# EAGLE design pandora_A_v1 (EAGLE 9.6.2)
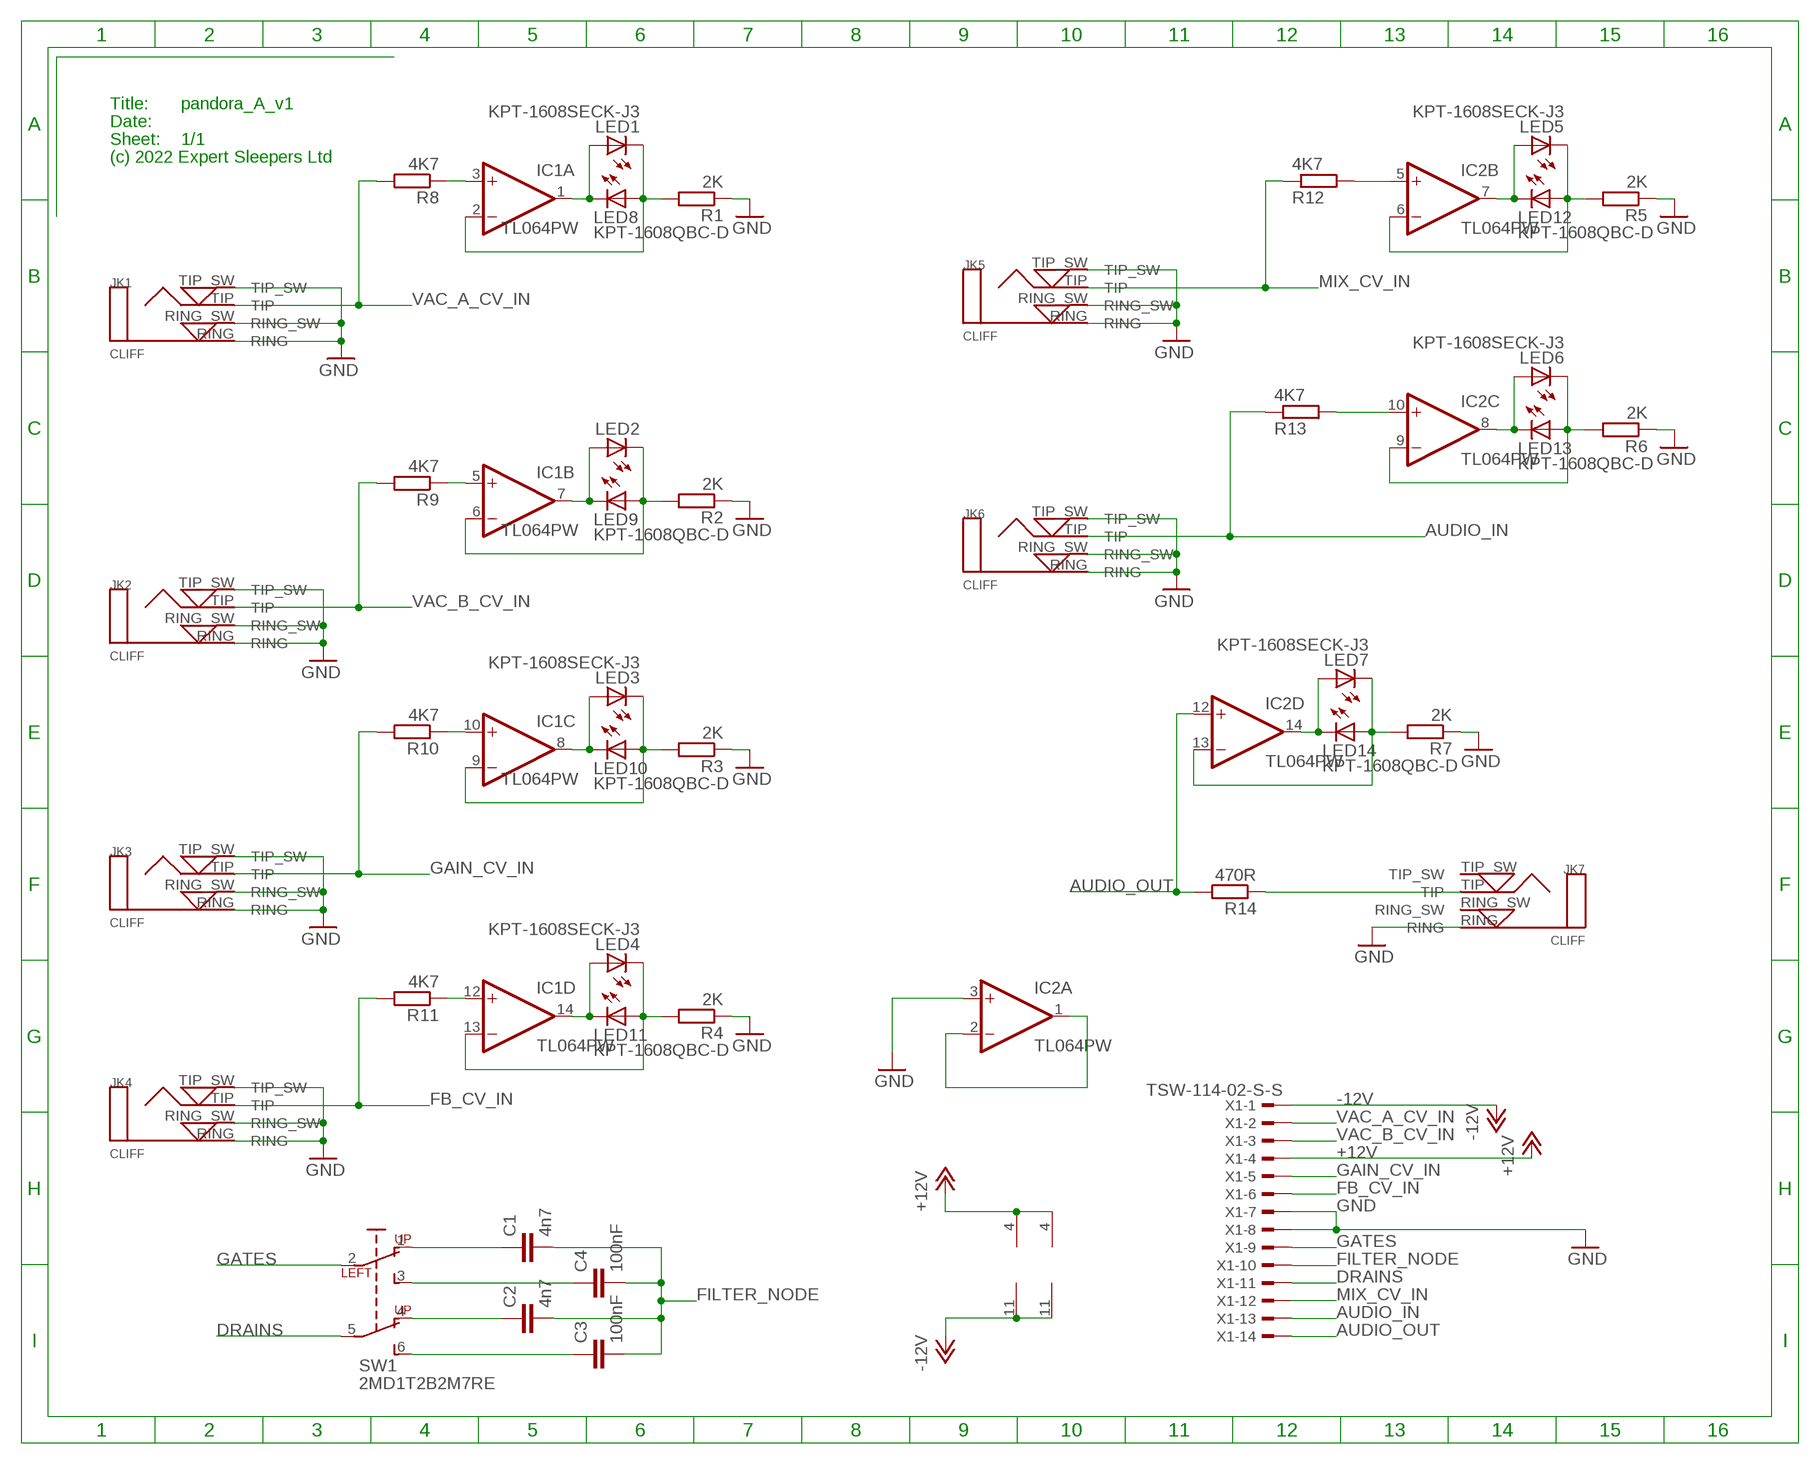
[diagram p0: schematic, sheet 1]

## Parts
C1  4n7  C-EUC0805  [C0805]
C2  4n7  C-EUC0805  [C0805]
C3  100nF  C-EUC1206  [C1206]
C4  100nF  C-EUC1206  [C1206]
IC1  TL064PW  TL074PW  [PW_R-PDSO-G14]
IC2  TL064PW  TL074PW  [PW_R-PDSO-G14]
JK1  CLIFF  CLIFF3.5MM_PCB_SW_JK  [CLIFF3.5MMPCB]
JK2  CLIFF  CLIFF3.5MM_PCB_SW_JK  [CLIFF3.5MMPCB]
JK3  CLIFF  CLIFF3.5MM_PCB_SW_JK  [CLIFF3.5MMPCB]
JK4  CLIFF  CLIFF3.5MM_PCB_SW_JK  [CLIFF3.5MMPCB]
JK5  CLIFF  CLIFF3.5MM_PCB_SW_JK  [CLIFF3.5MMPCB]
JK6  CLIFF  CLIFF3.5MM_PCB_SW_JK  [CLIFF3.5MMPCB]
JK7  CLIFF  CLIFF3.5MM_PCB_SW_JK  [CLIFF3.5MMPCB]
LED1  KPT-1608SECK-J3  [CHIPLED_0603_LEFT]
LED2  KPT-1608SECK-J3  [CHIPLED_0603_LEFT]
LED3  KPT-1608SECK-J3  [CHIPLED_0603_LEFT]
LED4  KPT-1608SECK-J3  [CHIPLED_0603_LEFT]
LED5  KPT-1608SECK-J3  [CHIPLED_0603_LEFT]
LED6  KPT-1608SECK-J3  [CHIPLED_0603_LEFT]
LED7  KPT-1608SECK-J3  [CHIPLED_0603_LEFT]
LED8  KPT-1608QBC-D  [CHIPLED_0603_RIGHT]
LED9  KPT-1608QBC-D  [CHIPLED_0603_RIGHT]
LED10  KPT-1608QBC-D  [CHIPLED_0603_RIGHT]
LED11  KPT-1608QBC-D  [CHIPLED_0603_RIGHT]
LED12  KPT-1608QBC-D  [CHIPLED_0603_RIGHT]
LED13  KPT-1608QBC-D  [CHIPLED_0603_RIGHT]
LED14  KPT-1608QBC-D  [CHIPLED_0603_RIGHT]
R1  2K  R-EU_R1206  [R1206]
R2  2K  R-EU_R1206  [R1206]
R3  2K  R-EU_R1206  [R1206]
R4  2K  R-EU_R1206  [R1206]
R5  2K  R-EU_R1206  [R1206]
R6  2K  R-EU_R1206  [R1206]
R7  2K  R-EU_R1206  [R1206]
R8  4K7  R-EU_R1206  [R1206]
R9  4K7  R-EU_R1206  [R1206]
R10  4K7  R-EU_R1206  [R1206]
R11  4K7  R-EU_R1206  [R1206]
R12  4K7  R-EU_R1206  [R1206]
R13  4K7  R-EU_R1206  [R1206]
R14  470R  R-EU_R1206  [R1206]
SW1  2MD1T2B2M7RE  [2MD1T2B2M7RE]
X1  TSW-114-02-S-S  [TSW-114-02-S-S]

## Nets
+12V: IC1.4(P:V+) IC2.4(P:V+) X1.4
-12V: IC1.11(P:V-) IC2.11(P:V-) X1.1
AUDIO_IN: JK6.TIP R13.1 X1.13
AUDIO_OUT: IC2.12(D:+IN) R14.2 X1.14
DRAINS: SW1.5(PR) X1.11
FB_CV_IN: JK4.TIP R11.2 X1.6
FILTER_NODE: C1.2 C2.2 C3.2 C4.2 X1.10
GAIN_CV_IN: JK3.TIP R10.2 X1.5
GATES: SW1.2(PL) X1.9
GND [power]: IC2.3(A:+IN) JK1.RING JK1.RING_SW JK1.TIP_SW JK2.RING JK2.RING_SW JK2.TIP_SW JK3.RING JK3.RING_SW JK3.TIP_SW JK4.RING JK4.RING_SW JK4.TIP_SW JK5.RING JK5.RING_SW JK5.TIP_SW JK6.RING JK6.RING_SW JK6.TIP_SW JK7.RING R1.1 R2.1 R3.1 R4.1 R5.1 R6.1 R7.1 X1.7 X1.8
MIX_CV_IN: JK5.TIP R12.1 X1.12
N$3: IC1.10(C:+IN) R10.1
N$4: IC1.13(D:-IN) LED4.1(C) LED11.1(A) R4.2
N$5: IC1.14(D:OUT) LED4.2(A) LED11.2(C)
N$6: IC2.1(A:OUT) IC2.2(A:-IN)
N$8: IC1.12(D:+IN) R11.1
N$11: IC1.8(C:OUT) LED3.2(A) LED10.2(C)
N$16: IC1.5(B:+IN) R9.1
N$17: IC1.9(C:-IN) LED3.1(C) LED10.1(A) R3.2
N$19: IC1.1(A:OUT) LED1.2(A) LED8.2(C)
N$21: IC2.10(C:+IN) R13.2
N$22: IC1.2(A:-IN) LED1.1(C) LED8.1(A) R1.2
N$25: IC1.3(A:+IN) R8.1
N$29: IC1.7(B:OUT) LED2.2(A) LED9.2(C)
N$30: IC1.6(B:-IN) LED2.1(C) LED9.1(A) R2.2
N$47: IC2.5(B:+IN) R12.2
N$62: IC2.8(C:OUT) LED6.2(A) LED13.2(C)
N$63: IC2.9(C:-IN) LED6.1(C) LED13.1(A) R6.2
N$65: IC2.14(D:OUT) LED7.2(A) LED14.2(C)
N$66: IC2.13(D:-IN) LED7.1(C) LED14.1(A) R7.2
N$71: IC2.7(B:OUT) LED5.2(A) LED12.2(C)
N$72: IC2.6(B:-IN) LED5.1(C) LED12.1(A) R5.2
N$76: JK7.TIP R14.1
N$78: C1.1 SW1.1(LU)
N$79: C2.1 SW1.4(RU)
N$80: C4.1 SW1.3(LD)
N$81: C3.1 SW1.6(RD)
VAC_A_CV_IN: JK1.TIP R8.2 X1.2
VAC_B_CV_IN: JK2.TIP R9.2 X1.3
Unconnected: JK7.RING_SW JK7.TIP_SW

## Notes on the sheet
- Title:
- Date:
- Sheet:
- (c) 2022 Expert Sleepers Ltd

## Library data of the parts
C1-C4 = rcl:C-EU: CAPACITOR, European symbol
IC1 IC2 = digital-audio:TL074: OP AMP
JK1-JK7 = cliff:CLIFF3.5MM_PCB_SW_JK: Cliff 3.5mm Mono PCB switched jack socket
LED1-LED7 = kingbright:KPT-1608SECK-J3
LED8-LED14 = kingbright:KPT-1608QBC-D
R1-R14 = rcl:R-EU_: RESISTOR, European symbol
SW1 = switch-multicomp:2MD1T2B2M7RE: TINY SWITCH ON - ON Source: http://www2.produktinfo.conrad.com/datenblaetter/700000-724999/705152-da-01-de-Subminiaturschalter_TL_36WO.pdf
X1 = con-samtec:TSW-114-02-S-S: THROUGH-HOLE .025" SQ POST HEADER Source: Samtec TSW.pdf; OC_FARNELL: unknown; OC_NEWARK: unknown

## Board
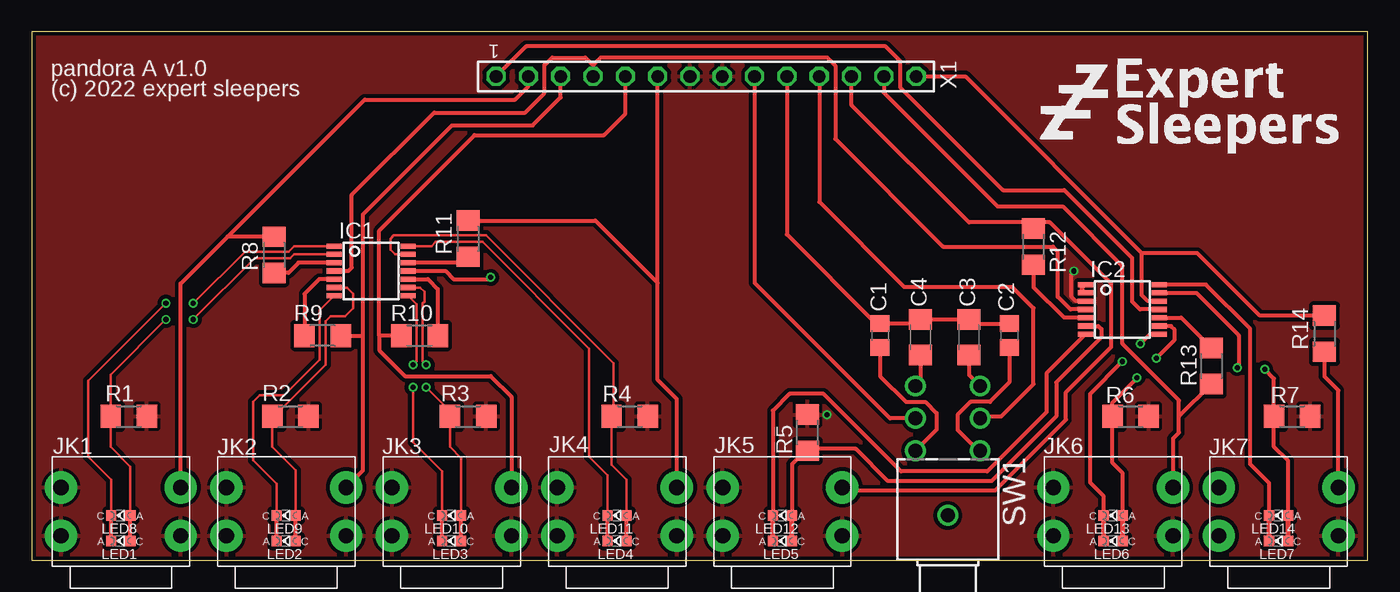
[diagram p1: board, top side]
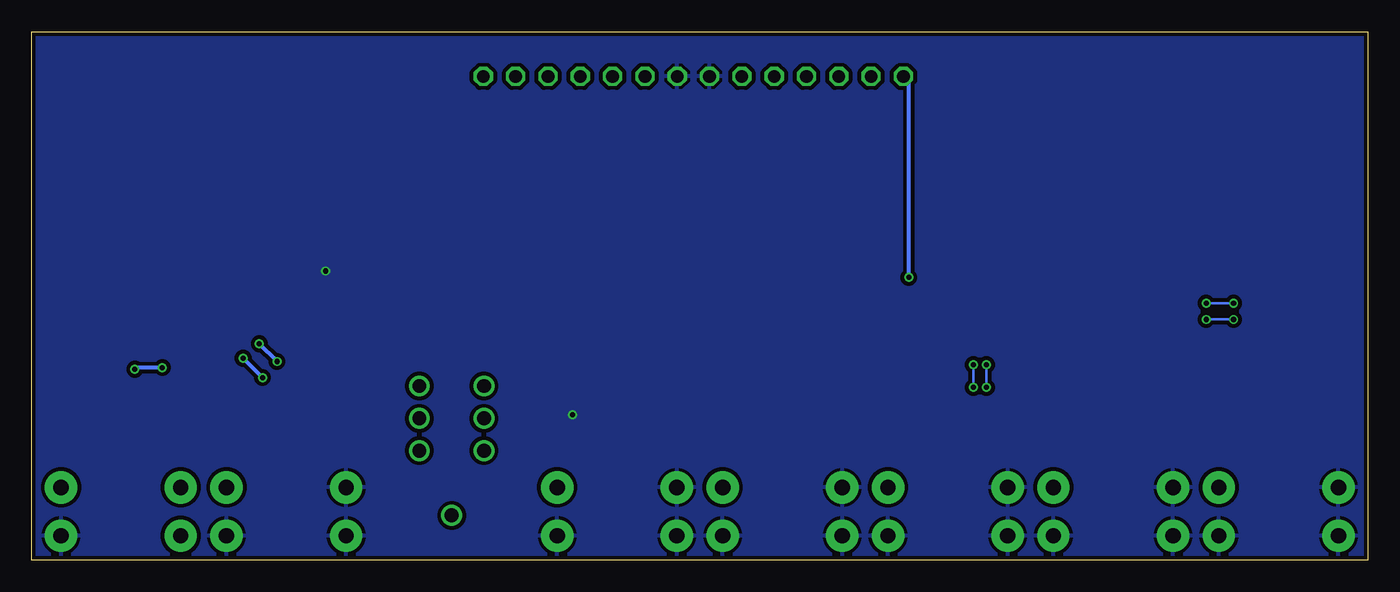
[diagram p2: board, bottom side, seen from below]

Size 105 x 41.5 mm. Coordinates in mm from the lower left corner, seen from the top.
Outline: 0,0 105,0 105,41.5 0,41.5 0,0
Copper layers (1*16): Top 0.035mm / dielectric 1.5mm / Bottom 0.035mm
Design rules "pcbtrain *": minimum track width 0.125mm, minimum drill 0.3mm, track to track 0.125mm, track to pad 0.125mm, pad to pad 0.125mm, via to via 0.125mm, smd to smd 0.125mm, copper to edge 0.25mm, drill to drill 8mil, minimum pad ring 0.15mm, minimum via ring 0.15mm, stop-mask expansion 4mil, vias tented up to drill 0mil, thermal gap 10mil

### Footprints (pad centres in the part's own frame; a part is rotated, then mirrored left to right if it is on the bottom)
C0805 = smd 1.3 x 1.5: 1 -0.95,0; 2 0.95,0
C1206 = smd 1.6 x 1.8: 1 -1.4,0; 2 1.4,0
PW_R-PDSO-G14 = smd 0.4 x 1.2: 1 -1.95,-2.9; 2 -1.3,-2.9; 3 -0.65,-2.9; 4 0,-2.9; 5 0.65,-2.9; 6 1.3,-2.9; 7 1.95,-2.9; 8 1.95,2.9; 9 1.3,2.9; 10 0.65,2.9; 11 0,2.9; 12 -0.65,2.9; 13 -1.3,2.9; 14 -1.95,2.9
CLIFF3.5MMPCB = drill 1.2 pad 2.54: RING 4.7,-1.9; RING_SW -4.7,-1.9; TIP 4.7,1.9; TIP_SW -4.7,1.9
CHIPLED_0603_LEFT = smd 0.8 x 0.8: 1 0,-0.75; 2 0,0.75
CHIPLED_0603_RIGHT = smd 0.8 x 0.8: 1 0,-0.75; 2 0,0.75
R1206 = smd 1.6 x 1.803: 1 -1.422,0; 2 1.422,0
2MD1T2B2M7RE = drill 1.092: 1 -2.54,5.08; 2 -2.54,7.62; 3 -2.54,10.16; 4 2.54,5.08; 5 2.54,7.62; 6 2.54,10.16; 7 0,0
TSW-114-02-S-S = drill 1 pad 1.5 octagon: 1 16.51,0; 2 13.97,0; 3 11.43,0; 4 8.89,0; 5 6.35,0; 6 3.81,0; 7 1.27,0; 8 -1.27,0; 9 -3.81,0; 10 -6.35,0; 11 -8.89,0; 12 -11.43,0; 13 -13.97,0; 14 -16.51,0

### Placement (x,y rotation side)
C1  66.67,17.63 90 top
C2  76.83,17.63 90 top
C3  73.66,17.5 90 top
C4  69.85,17.5 90 top
IC1  26.67,22.71 270 top
IC2  85.72,19.68 270 top
JK1  7,3.8 0 top
JK2  20,3.8 0 top
JK3  33,3.8 0 top
JK4  46,3.8 0 top
JK5  59,3.8 0 top
JK6  85,3.8 0 top
JK7  98,3.8 0 top
LED1  7,1.5 90 top
LED2  20,1.5 90 top
LED3  33,1.5 90 top
LED4  46,1.5 90 top
LED5  59,1.5 90 top
LED6  85,1.5 90 top
LED7  98,1.5 90 top
LED8  7,3.5 90 top
LED9  20,3.5 90 top
LED10  33,3.5 90 top
LED11  46,3.5 90 top
LED12  59,3.5 90 top
LED13  85,3.5 90 top
LED14  98,3.5 90 top
R1  7.62,11.28 180 top
R2  20.32,11.28 180 top
R3  34.29,11.28 180 top
R4  46.99,11.28 180 top
R5  60.96,10.01 270 top
R6  86.36,11.28 180 top
R7  99.06,11.28 180 top
R8  19.05,23.98 90 top
R9  22.86,17.63 0 top
R10  30.48,17.63 180 top
R11  34.29,25.25 90 top
R12  78.74,24.61 270 top
R13  92.71,15.24 90 top
R14  101.6,17.78 90 top
SW1  72,3.51 0 top
U$1  [ES_ZZZ_TEXT_TPLACE_1IN_600DPI]  78.28,31.53 0 top
X1  53,38 180 top

### Tracks (layer width: path | path; a pad name or v marks a point on that pad's centre or on a via)
+12V
  Top 0.305: IC2.4 81.64,19.68 80.64,20.68 80.64,24.23 80.26,24.61 71.63,24.61 63.16,33.08 63.16,38.84 62.52,39.47 44.7,39.47 44.11,38.88 | 44.11,38.88 X1.4 | IC1.4 24.89,22.71 25.15,22.96 25.15,28.68 31.62,35.16 38.78,35.16 40.3,36.68 40.3,38.88 40.89,39.47 43.52,39.47 44.11,38.88
-12V  (via drill 0.4)
  Top 0.305: v36.07,22.2 35.94,22.07 33.15,22.07 32.51,22.71 IC1.11 | IC2.11 87.1,19.68 86.49,20.3 86.49,23.73 81.15,29.06 76.33,29.06 68.24,37.15 68.24,39.22 67.1,40.36 38.85,40.36 X1.1
  Bottom 0.305: v36.07,22.2 36.07,37.58 X1.1
AUDIO_IN
  Top 0.305: JK6.TIP 89.7,9.54 90.17,10.01 90.17,11.28 | R13.1 90.17,11.28 | 90.17,11.28 90.17,12.55 85.72,17 85.72,23.09 81.03,27.79 75.91,27.79 66.97,36.73 X1.13
AUDIO_OUT
  Top 0.305: IC2.12 87.74,20.34 87.23,20.84 87.23,24.12 87.26,24.12 | R14.2 96.52,19.2 91.6,24.12 87.26,24.12 | X1.14 73.38,38 87.26,24.12
DRAINS
  Top 0.305: SW1.5 74.69,11.28 76.2,11.28 78.74,13.82 78.74,19.79 77.09,21.44 68.58,21.44 61.89,28.13 X1.11
FB_CV_IN
  Top 0.305: JK4.TIP 50.7,12.65 49.19,14.16 49.19,21.78 | 49.19,21.78 X1.6 | R11.2 44.3,26.67 49.19,21.78
FILTER_NODE
  Top 0.305: C2.2 73.98,18.58 C3.2 C4.2 69.53,18.58 C1.2 66.36,18.58 59.35,25.59 X1.10
GAIN_CV_IN
  Top 0.305: 27.3,17.63 27.3,25.89 34.8,33.38 44.96,33.38 46.65,35.07 X1.5 | R10.2 27.3,17.63 | 27.3,17.63 27.3,16.49 29.34,14.46 36.07,14.46 37.7,12.82 JK3.TIP
GATES
  Top 0.305: SW1.2 67.46,11.13 56.81,21.78 X1.9
GND  (via drill 0.4)
  Top 0.305: IC2.3 82.06,20.34 81.68,20.72 81.68,22.43 81.92,22.67 v81.92,22.71
  other vias: 62.48,11.41
  pour Top (isolate 0.305): 0,0 105,0 105,41.5 0,41.5
  pour Bottom (isolate 0.305): 0,0 105,0 105,41.5 0,41.5
MIX_CV_IN
  Top 0.305: JK5.TIP 63.95,5.45 75.7,5.45 81.28,11.03 81.28,13.19 84.84,16.74 84.84,21.69 80.01,26.52 78.74,26.52 | 78.74,26.52 73.66,26.52 64.43,35.75 X1.12 | R12.1 78.74,26.52
N$3
  Top 0.305: IC1.10 31.13,22.06 31.9,21.29 R10.1
N$4
  Top 0.203: IC1.13 28.55,24.01 28.19,24.36 28.19,25.25 28.45,25.5 35.69,25.5 45.72,15.47 45.72,11.43 R4.2 45.57,7.5 46.75,6.31 LED11.1
  Top 0.305: LED4.1 LED11.1
N$5
  Top 0.203: LED11.2 45.25,6.67 43.81,8.11 43.81,16.61 35.43,25 31.75,25 31.41,24.66 IC1.14
  Top 0.305: LED4.2 LED11.2
N$6
  Top 0.305: IC2.2 82.5,21.31 IC2.1
N$8
  Top 0.305: R11.1 33.82,23.36 IC1.12
N$11  (via drill 0.4)
  Top 0.203: IC1.8 30.23,20.1 30.23,15.6 v29.97,15.34 | v29.97,13.57 29.97,9.25 32.25,6.97 LED10.2
  Top 0.305: LED3.2 LED10.2
  Bottom 0.203: v29.97,15.34 v29.97,13.57
N$16
  Top 0.305: IC1.5 22.59,22.06 21.44,20.91 R9.1
N$17  (via drill 0.4)
  Top 0.203: IC1.9 30.51,21.41 30.86,21.06 30.86,20.3 30.73,20.17 30.73,15.6 v30.99,15.34 | v30.99,13.57 32.87,11.69 R3.2 32.87,8.89 33.75,8.01 LED10.1
  Top 0.305: LED3.1 LED10.1
  Bottom 0.203: v30.99,15.34 v30.99,13.57
N$19  (via drill 0.4)
  Top 0.203: IC1.1 20.62,24.66 20.19,24.23 16.76,24.23 v12.7,20.17 | v10.54,20.17 4.45,14.07 4.45,8.11 6.25,6.3 LED8.2
  Top 0.305: LED1.2 LED8.2
  Bottom 0.203: v12.7,20.17 v10.54,20.17
N$21
  Top 0.305: IC2.10 90.34,19.04 R13.2
N$22  (via drill 0.4)
  Top 0.203: IC1.2 20.6,24.01 20.32,23.73 17.53,23.73 v12.7,18.9 | v10.54,18.9 6.2,14.56 R1.2 6.2,8.89 7.75,7.34 LED8.1
  Top 0.305: LED1.1 LED8.1
  Bottom 0.203: v12.7,18.9 v10.54,18.9
N$25
  Top 0.305: IC1.3 20.97,23.36 20.17,22.56 R8.1
N$29
  Top 0.203: LED9.2 19.25,6 17.4,7.85 17.4,12.42 17.91,12.93 19.85,12.93 22.64,15.72 22.64,19.63 IC1.7
  Top 0.305: LED2.2 LED9.2
N$30
  Top 0.203: IC1.6 24.8,21.41 25.27,20.93 25.27,19.79 24.64,19.15 23.5,19.15 23.11,18.77 23.11,15.34 19.05,11.28 R2.2 18.9,8.89 20.75,7.04 LED9.1
  Top 0.305: LED2.1 LED9.1
N$47
  Top 0.305: IC2.5 81.14,19.04 78.74,21.44 R12.2
N$62  (via drill 0.4)
  Top 0.305: v85.72,15.6 83.19,13.06 83.19,6.07 84.25,5.01 LED13.2 | IC2.8 87.86,17.73 v87.12,17
  Top 0.406: LED6.2 LED13.2
  Bottom 0.305: v85.72,15.6 v87.12,17
N$63  (via drill 0.4)
  Top 0.305: v86.87,14.33 86.87,14.3 84.94,12.37 R6.2 84.94,7.62 85.75,6.81 LED13.1 | IC2.9 89.54,18.39 89.79,18.14 89.79,17.25 v88.39,15.85
  Top 0.406: LED6.1 LED13.1
  Bottom 0.305: v86.87,14.33 v88.39,15.85
N$65
  Top 0.305: LED14.2 97.25,6.04 95.76,7.53 95.76,18.16 92.28,21.64 IC2.14
  Top 0.406: LED7.2 LED14.2
N$66  (via drill 0.4)
  Top 0.305: IC2.13 91.54,20.98 94.87,17.65 94.87,15.24 v94.74,15.11 | LED14.1 98.75,7.78 97.64,8.89 R7.2 97.64,14.25 v96.9,14.99
  Top 0.406: LED7.1 LED14.1
  Bottom 0.305: v94.74,15.11 96.77,15.11 v96.9,14.99
N$71
  Top 0.305: IC2.7 79.76,14.67 79.76,11.62 75.1,6.96 68.33,6.96 62.23,13.06 59.56,13.06 58.25,11.74 LED12.2
  Top 0.406: LED5.2 LED12.2
N$72
  Top 0.305: IC2.6 83.83,18.39 84.07,18.14 84.07,17.5 80.52,13.95 80.52,11.28 75.44,6.2 67.31,6.2 64.77,8.74 60.96,8.74 | 60.96,8.74 59.75,7.53 LED12.1 | R5.2 60.96,8.74
  Top 0.406: LED5.1 LED12.1
N$76
  Top 0.305: JK7.TIP 102.7,13.32 101.6,14.42 R14.1
N$78
  Top 0.305: C1.1 66.67,14.46 68.71,12.42 70.23,12.42 71.12,11.53 71.12,10.25 SW1.1
N$79
  Top 0.305: C2.1 76.83,13.95 75.31,12.42 73.79,12.42 72.77,11.41 72.77,10.23 74.41,8.59 SW1.4
N$80
  Top 0.305: C4.1 69.85,14.06 SW1.3
N$81
  Top 0.305: C3.1 73.66,14.55 SW1.6
VAC_A_CV_IN
  Top 0.305: JK1.TIP 11.7,21.71 15.39,25.4 | X1.2 39.03,37.23 37.97,36.17 26.16,36.17 15.39,25.4 | R8.2 15.39,25.4
VAC_B_CV_IN
  Top 0.305: JK2.TIP 26.04,7.04 26.04,17.63 | 26.04,17.63 26.04,27.16 33.02,34.14 39.37,34.14 41.57,36.34 X1.3 | R9.2 26.04,17.63

### Text on the board
tPlace: pandora A v1.0 | (c) 2022 expert sleepers